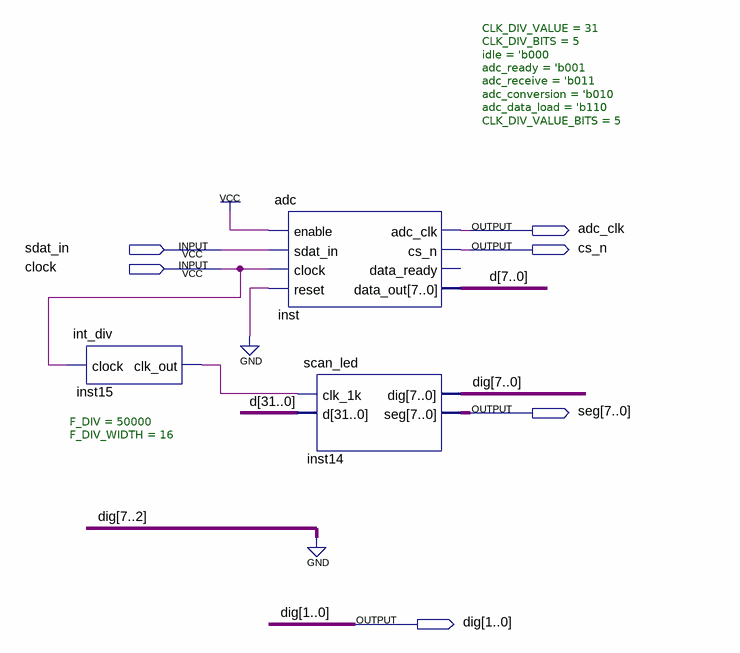
[diagram p0: schematic sheet]
// Quartus schematic tlc549adc.bdf as structural Verilog: 3 symbols, 6 pins
module tlc549adc (
  input  sdat_in,
  input  clock,
  output adc_clk,
  output cs_n,
  output [7:0] seg,
  output [7:0] dig
);

  wire inst15_clk_out;
  wire [31:0] d;

  int_div #(.F_DIV(50000), .F_DIV_WIDTH(16)) inst15 (.clock(clock), .clk_out(inst15_clk_out));
  adc #(.CLK_DIV_VALUE(31), .CLK_DIV_BITS(5), .idle('b000), .adc_ready('b001), .adc_receive('b011), .adc_conversion('b010), .adc_data_load('b110), .CLK_DIV_VALUE_BITS(5)) inst (
    .clock(clock), .reset(1'b0), .enable(1'b1), .sdat_in(sdat_in), .adc_clk(adc_clk), .cs_n(cs_n),
    .data_out(d[7:0]));  // open: data_ready
  scan_led inst14 (.clk_1k(inst15_clk_out), .d(d), .dig(dig), .seg(seg));
  // also tied to GND on the sheet: {dig[2], dig[3], dig[4], dig[5], dig[6], dig[7]}
endmodule
